# Altium project Base.PrjPcb
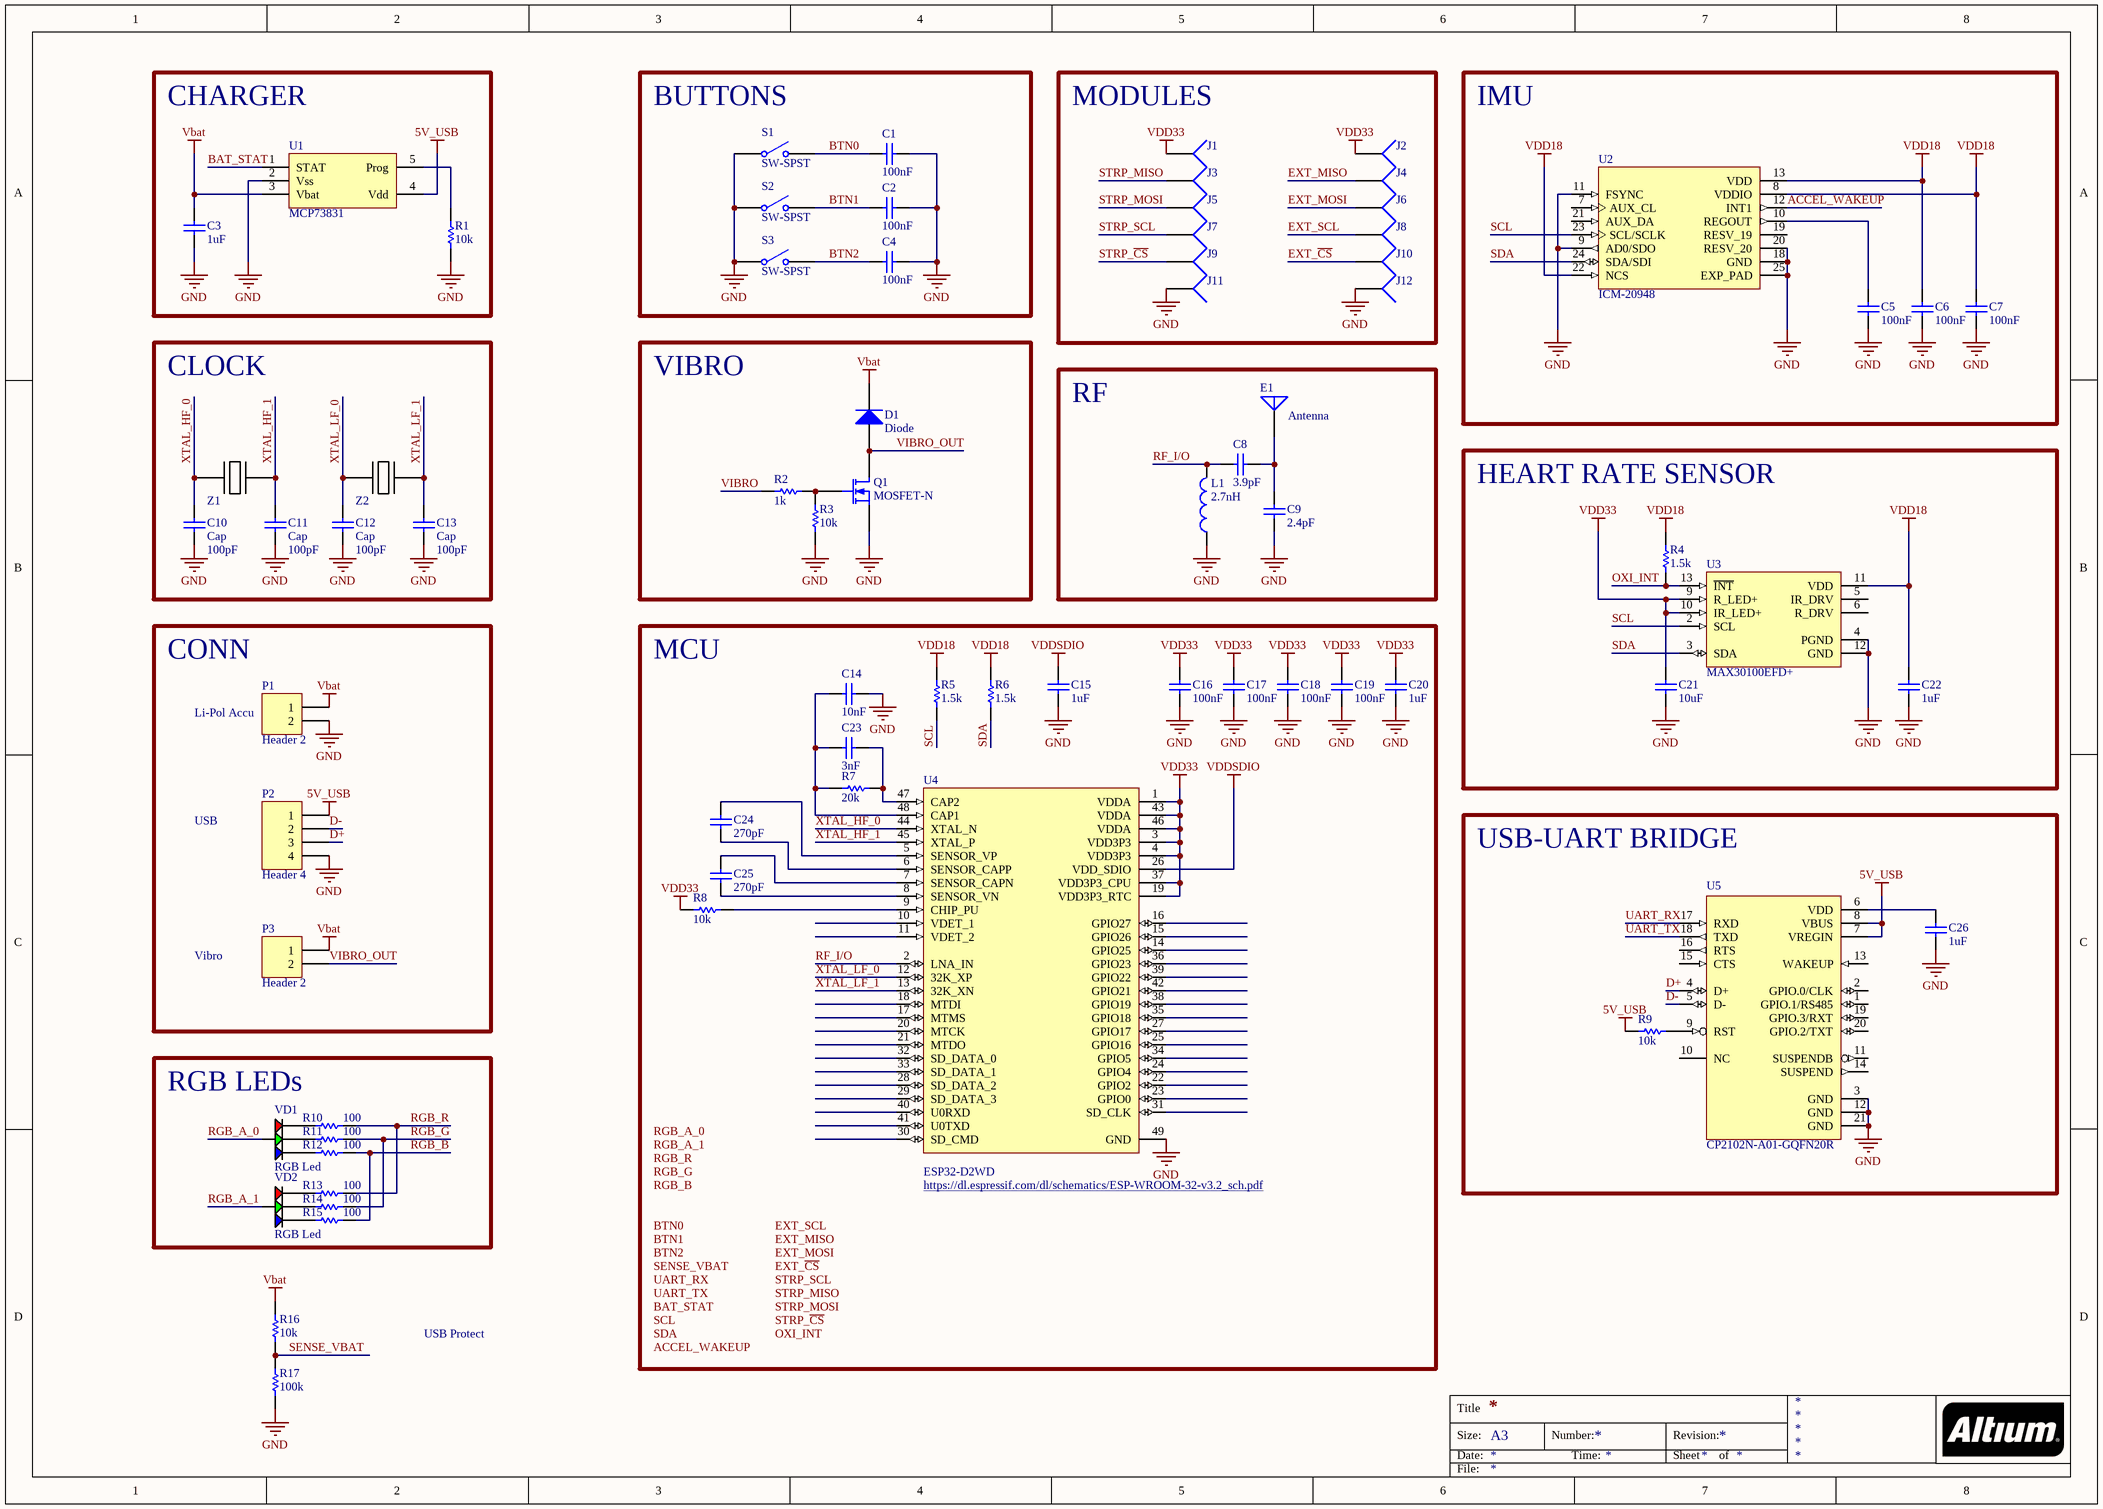
[diagram p0: base_schematic.SchDoc]
1 sheet, 74 parts. Net scope: global (net labels, ports and power ports of the same name join across sheets).
Board file: base_pcb.PcbDoc

## Sheet base_schematic.SchDoc
size A3

### Parts
C1  100nF  [RAD-0.3]
C2  100nF  [RAD-0.3]
C3  1uF  [RAD-0.3]
C4  100nF  [RAD-0.3]
C5  100nF  [RAD-0.3]
C6  100nF  [RAD-0.3]
C7  100nF  [RAD-0.3]
C8  3.9pF  [RAD-0.3]
C9  2.4pF  [RAD-0.3]
C10  Cap  value 100pF  [RAD-0.3]
C11  Cap  value 100pF  [RAD-0.3]
C12  Cap  value 100pF  [RAD-0.3]
C13  Cap  value 100pF  [RAD-0.3]
C14  10nF  [RAD-0.3]
C15  1uF  [RAD-0.3]
C16  100nF  [RAD-0.3]
C17  100nF  [RAD-0.3]
C18  100nF  [RAD-0.3]
C19  100nF  [RAD-0.3]
C20  1uF  [RAD-0.3]
C21  10uF  [RAD-0.3]
C22  1uF  [RAD-0.3]
C23  3nF  [RAD-0.3]
C24  270pF  [RAD-0.3]
C25  270pF  [RAD-0.3]
C26  1uF  [RAD-0.3]
D1  Diode  [SMC]
E1  Antenna  [PIN1]
J1  Socket  [PIN1]  (value not drawn)
J2  Socket  [PIN1]  (value not drawn)
J3  Socket  [PIN1]  (value not drawn)
J4  Socket  [PIN1]  (value not drawn)
J5  Socket  [PIN1]  (value not drawn)
J6  Socket  [PIN1]  (value not drawn)
J7  Socket  [PIN1]  (value not drawn)
J8  Socket  [PIN1]  (value not drawn)
J9  Socket  [PIN1]  (value not drawn)
J10  Socket  [PIN1]  (value not drawn)
J11  Socket  [PIN1]  (value not drawn)
J12  Socket  [PIN1]  (value not drawn)
L1  2.7nH  [0402-A]
P1  Header 2  [HDR1X2]
P2  Header 4  [HDR1X4]
P3  Header 2  [HDR1X2]
Q1  MOSFET-N  [E3]
R1  10k  [AXIAL-0.3]
R2  1k  [AXIAL-0.3]
R3  10k  [AXIAL-0.3]
R4  1.5k  [AXIAL-0.3]
R5  1.5k  [AXIAL-0.3]
R6  1.5k  [AXIAL-0.3]
R7  20k  [AXIAL-0.3]
R8  10k  [AXIAL-0.3]
R9  10k  [AXIAL-0.3]
R10  100  [AXIAL-0.3]
R11  100  [AXIAL-0.3]
R12  100  [AXIAL-0.3]
R13  100  [AXIAL-0.3]
R14  100  [AXIAL-0.3]
R15  100  [AXIAL-0.3]
R16  10k  [AXIAL-0.3]
R17  100k  [AXIAL-0.3]
S1  SW-SPST  [SPST-2]
S2  SW-SPST  [SPST-2]
S3  SW-SPST  [SPST-2]
U1  MCP73831  [SOT23-5]
U2  ICM-20948  [QFN40P300X300X105-25N]
U3  MAX30100EFD+  [LGA14R80P2X7_560X280X130]
U4  ESP32-D2WD  [QFN35P500X500X90-49N]
U5  CP2102N-A01-GQFN20R  [SILABS_QFN20]
VD1  RGB Led
VD2  RGB Led
Z1  (no value)  [RR_CRYSTAL_3.2X1.3]
Z2  (no value)  [RR_CRYSTAL_3.2X1.3]

### Blocks framed on the sheet
CHARGER: C3 R1 U1
BUTTONS: C1 C2 C4 S1-S3
MODULES: J1-J12
IMU: C5-C7 U2
CLOCK: C10-C13 Z1 Z2
VIBRO: D1 Q1 R2 R3
RF: C8 C9 E1 L1
HEART RATE SENSOR: C21 C22 R4 U3
CONN: P1-P3
MCU: C14-C20 C23-C25 R5-R8 U4
USB-UART BRIDGE: C26 R9 U5
RGB LEDs: R10-R15 VD1 VD2

### Nets
5V_USB: P2.1 R9.2 U1.4(Vdd) U5.7(VREGIN) U5.8(VBUS)
GND: C1.1 C2.1 C3.1 C4.1 C5.1 C6.1 C7.1 C9.1 C10.1 C11.1 C12.1 C13.1 C14.2 C15.1 C16.1 C17.1 C18.1 C19.1 C20.1 C21.1 C22.1 C26.1 J11.1 J12.1 L1.1 P1.2 P2.4 Q1.3(S) R1.2 R3.1 R17.1 S1.1(COMMON) S2.1(COMMON) S3.1(COMMON) U1.2(Vss) U2.9(AD0/SDO) U2.11(FSYNC) U2.18(GND) U2.20(RESV_20) U2.25(EXP_PAD) U3.4(PGND) U3.12(GND) U4.49(GND) U5.3(GND) U5.12(GND) U5.21(GND)
Vbat: C3.2 D1.2(K) P1.1 P3.1 R16.2 U1.3(Vbat)
VDD18: C6.2 C7.2 C22.2 R4.2 R5.2 R6.2 U2.8(VDDIO) U2.13(VDD) U2.22(NCS) U3.11(VDD)
VDD33: C16.2 C17.2 C18.2 C19.2 C20.2 C21.2 J1.1 J2.1 R8.1 U3.9(R_LED+) U3.10(IR_LED+) U4.1(VDDA) U4.3(VDD3P3) U4.4(VDD3P3) U4.19(VDD3P3_RTC) U4.37(VDD3P3_CPU) U4.43(VDDA) U4.46(VDDA)
VDDSDIO: C15.2 U4.26(VDD_SDIO)
ACCEL_WAKEUP: U2.12(INT1)
BAT_STAT: U1.1(STAT)
BTN0: C1.2 S1.2(NO)
BTN1: C2.2 S2.2(NO)
BTN2: C4.2 S3.2(NO)
D+: P2.3 U5.4(D+)
D-: P2.2 U5.5(D-)
EXT_~{CS}: J10.1
EXT_MISO: J4.1
EXT_MOSI: J6.1
EXT_SCL: J8.1
OXI_INT: R4.1 U3.13(~{INT})
RF_I/O: C8.2 L1.2 U4.2(LNA_IN)
RGB_A_0: VD1.2(C)
RGB_A_1: VD2.2(C)
RGB_B: R12.2 R15.2
RGB_G: R11.2 R14.2
RGB_R: R10.2 R13.2
SCL: R5.1 U2.23(SCL/SCLK) U3.2(SCL)
SDA: R6.1 U2.24(SDA/SDI) U3.3(SDA)
SENSE_VBAT: R16.1 R17.2
STRP_~{CS}: J9.1
STRP_MISO: J3.1
STRP_MOSI: J5.1
STRP_SCL: J7.1
UART_RX: U5.17(RXD)
UART_TX: U5.18(TXD)
VIBRO: R2.1
VIBRO_OUT: D1.1(A) P3.2 Q1.1(D)
XTAL_HF_0: C10.2 U4.44(XTAL_N) Z1.1(X1)
XTAL_HF_1: C11.2 U4.45(XTAL_P) Z1.3(X2)
XTAL_LF_0: C12.2 U4.12(32K_XP) Z2.1(X1)
XTAL_LF_1: C13.2 U4.13(32K_XN) Z2.3(X2)
NetC5_2: C5.2 U2.10(REGOUT)
NetC8_1: C8.1 C9.2 E1.1(A)
NetC14_1: C14.1 C23.1 R7.1 U4.48(CAP1)
NetC23_2: C23.2 R7.2 U4.47(CAP2)
NetC24_1: C24.1 U4.6(SENSOR_CAPP)
NetC24_2: C24.2 U4.5(SENSOR_VP)
NetC25_1: C25.1 U4.8(SENSOR_VN)
NetC25_2: C25.2 U4.7(SENSOR_CAPN)
NetC26_2: C26.2 U5.6(VDD)
NetQ1_2: Q1.2(G) R2.2 R3.2
NetR1_1: R1.1 U1.5(Prog)
NetR8_2: R8.2 U4.9(CHIP_PU)
NetR9_1: R9.1 U5.9(RST)
NetR10_1: R10.1 VD1.1(R)
NetR11_1: R11.1 VD1.3(G)
NetR12_1: R12.1 VD1.4(B)
NetR13_1: R13.1 VD2.1(R)
NetR14_1: R14.1 VD2.3(G)
NetR15_1: R15.1 VD2.4(B)

Not connected (* = marked no-connect by the designer): U2 7(AUX_CL) 19(RESV_19) 21(AUX_DA); U3 5(IR_DRV) 6(R_DRV); U4 10(VDET_1) 11(VDET_2) 14(GPIO25) 15(GPIO26) 16(GPIO27) 17(MTMS) 18(MTDI) 20(MTCK) 21(MTDO) 22(GPIO2) 23(GPIO0) 24(GPIO4) 25(GPIO16) 27(GPIO17) 28(SD_DATA_2) 29(SD_DATA_3) 30(SD_CMD) 31(SD_CLK) 32(SD_DATA_0) 33(SD_DATA_1) 34(GPIO5) 35(GPIO18) 36(GPIO23) 38(GPIO19) 39(GPIO22) 40(U0RXD) 41(U0TXD) 42(GPIO21); U5 1(GPIO.1/RS485) 2(GPIO.0/CLK) 10(NC) 11(SUSPENDB) 13(WAKEUP) 14(SUSPEND) 15(CTS) 16(RTS) 19(GPIO.3/RXT) 20(GPIO.2/TXT)

### Notes on the sheet
- (near P1) Li-Pol Accu
- USB
- Vibro
- USB Protect
- Labels drawn without touching a wire or pin: ACCEL_WAKEUP, BAT_STAT, BTN0, BTN1, BTN2, EXT_MISO, EXT_MOSI, EXT_SCL, EXT_~{CS}, OXI_INT, RGB_A_0, RGB_A_1, RGB_B, RGB_G, RGB_R, SCL, SDA, SENSE_VBAT, STRP_MISO, STRP_MOSI, STRP_SCL, STRP_~{CS}, UART_RX, UART_TX
- Title
- Size:
- Date:
- A3
- Number:
- Time:
- Revision:
- Sheet
- of
- File:

### Library data of the parts
C1-C9 C14-C26 = Cap: Capacitor; Value: 100pF; Published: 8-Jun-2000; LatestRevisionDate: 17-Jul-2002; LatestRevisionNote: Re-released for DXP Platform.; PackageReference: RAD-0.3; Publisher: Altium Limited; PackageDescription: Radial Cap, Thru-Hole; 2 Leads; 0.3 in Pin Spacing
C10-C13 = Cap: Capacitor; Published: 8-Jun-2000; LatestRevisionDate: 17-Jul-2002; LatestRevisionNote: Re-released for DXP Platform.; PackageReference: RAD-0.3; Publisher: Altium Limited; PackageDescription: Radial Cap, Thru-Hole; 2 Leads; 0.3 in Pin Spacing
D1 = Diode: Default Diode; Published: 8-Jun-2000; LatestRevisionDate: 17-Jul-2002; LatestRevisionNote: Re-released for DXP Platform.; PackageVersion: Sep-1996; PackageReference: SMC; Publisher: Altium Limited; PackageDescription: DO-214-AB/SMC; 2 C-Bend Leads; Body 7.9 x 5.9 mm, inc. leads (LxW); Code_JEDEC: DO-214-AB
E1 = Antenna: Generic Antenna; Published: 24-Mar-1999; LatestRevisionDate: 17-Jul-2002; LatestRevisionNote: Re-released for DXP Platform.; PackageReference: PIN1; Publisher: Altium Limited
L1 = Inductor: Code_IEC: 1005; Value: 10mH; Published: 8-Jun-2000; LatestRevisionDate: 29-May-2009; LatestRevisionNote: IPC-7351 Footprint Added.; PackageReference: 0402-A; Publisher: Altium Limited; PackageDescription: Chip Inductor; Code_JEITA: 0402
P1 P3 = Header 2: Header, 2-Pin; LatestRevisionDate: 17-Jul-2002; LatestRevisionNote: Re-released for DXP Platform.; Publisher: Altium Limited
P2 = Header 4: Header, 4-Pin; LatestRevisionDate: 17-Jul-2002; LatestRevisionNote: Re-released for DXP Platform.; Publisher: Altium Limited
Q1 = MOSFET-N: N-Channel MOSFET; Published: 8-Jun-2000; LatestRevisionDate: 17-Jul-2002; LatestRevisionNote: Re-released for DXP Platform.; PackageVersion: 1995/1996; PackageReference: E3; Publisher: Altium Limited; PackageDescription: TO, Flat Index; 3 In-Line, Axial Leads; Body Dia. 4.6mm; Lead Dia. 0.5 mm (max)
R1 R3-R17 = Res1: Resistor; Value: 1K; Published: 8-Jun-2000; LatestRevisionDate: 17-Jul-2002; LatestRevisionNote: Re-released for DXP Platform.; PackageReference: AXIAL-0.3; Publisher: Altium Limited; PackageDescription: Axial Device, Thru-Hole; 2 Leads; 0.3 in Pin Spacing
R2 = Res1: Resistor; Published: 8-Jun-2000; LatestRevisionDate: 17-Jul-2002; LatestRevisionNote: Re-released for DXP Platform.; PackageReference: AXIAL-0.3; Publisher: Altium Limited; PackageDescription: Axial Device, Thru-Hole; 2 Leads; 0.3 in Pin Spacing; Value: 1K
S1-S3 = SW-SPST: Single-Pole, Single-Throw Switch; Published: 24-Mar-1999; LatestRevisionDate: 17-Jul-2002; LatestRevisionNote: Re-released for DXP Platform.; PackageReference: SPST-2; Publisher: Altium Limited; PackageDescription: Switch; 2 Leads
U2 = ICM-20948: 9 Axis=3 Axis Gyro+3 Axis Accel+Compass. Pin For Pin With m; MF: TDK InvenSense; SnapEDA_Link: https://www.snapeda.com/parts/ICM-20948/TDK%20InvenSense/view-part/?ref=snap; Package: QFN-24 InvenSense; Price: None; MP: ICM-20948; Availability: Unavailable; Value: *
U3 = MAX30100EFD+: Pulse Oximeter and Heart-Rate Sensor IC 14-Pin OLGA T/R; MF: Maxim Integrated; MP: MAX30100EFD+T; SnapEDA_Link: https://www.snapeda.com/parts/MAX30100EFD%2BT/Maxim%20Integrated/view-part/?ref=snap; Package: None; Price: None; Availability: Unavailable; Value: *
U4 = ESP32-D2WD: Smd Ic Esp32-D2wd, Dual Core Mcu; MF: Espressif Systems; Package: VFQFN-48 Espressif Systems; MP: ESP32-D2WD; SnapEDA_Link: https://www.snapeda.com/parts/ESP32-D2WD/Espressif%20Systems/view-part/?ref=snap; Price: None; Availability: Unavailable; Value: *; Datasheet: https://dl.espressif.com/dl/schematics/ESP-WROOM-32-v3.2_sch.pdf
U5 = CP2102N-A01-GQFN20R: Ic Bridge Usb To Uart 20qfn; MF: Silicon Labs; MP: CP2102N-A01-GQFN20R; Package: QFN-20 Silicon Labs; Availability: Unavailable; Price: None; SnapEDA_Link: https://www.snapeda.com/parts/CP2102N-A01-GQFN20R/Silicon%20Labs/view-part/?ref=snap; Value: *
Z1 Z2 = Crystal_smd
J1-J12 = Socket: LatestRevisionDate: 17-Jul-2002; LatestRevisionNote: Re-released for DXP Platform.; Publisher: Altium Limited